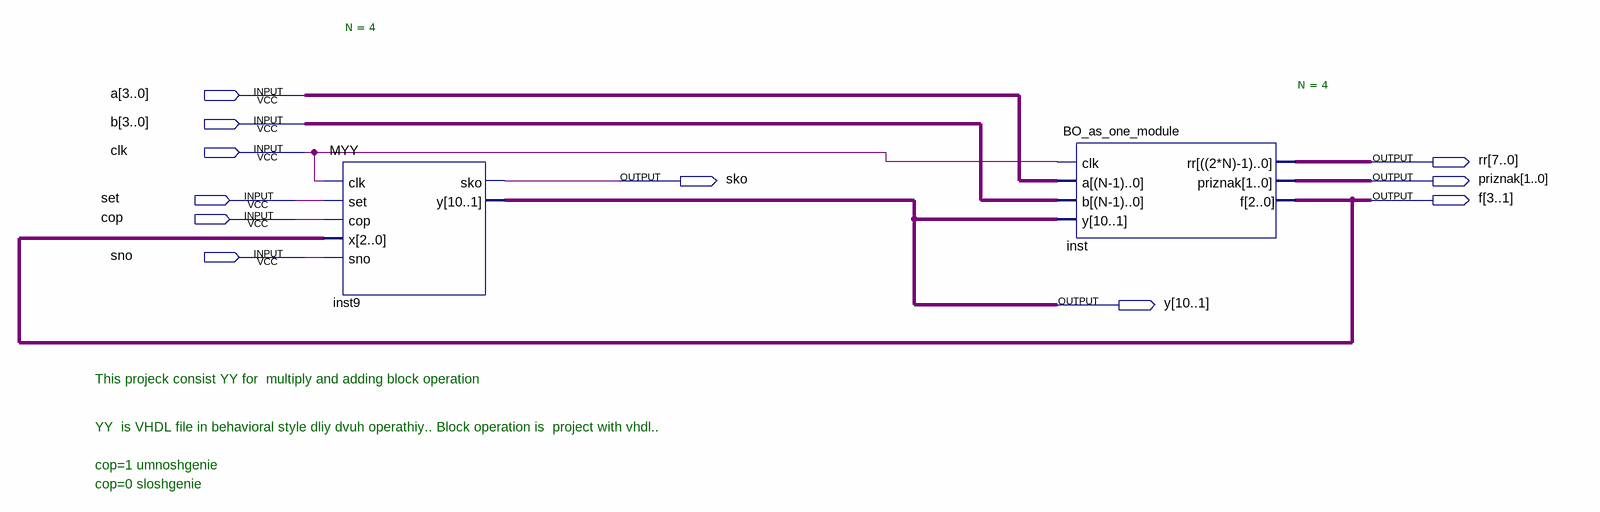
[diagram p0: schematic sheet]
// Quartus schematic alu_new.bdf as structural Verilog: 2 symbols, 11 pins
module alu_new (
  input  [3:0] a,
  input  [3:0] b,
  input  clk,
  input  set,
  input  cop,
  input  sno,
  output [7:0] rr,
  output sko,
  output [1:0] priznak,
  output [3:1] f,
  output [10:1] y
);

  MYY #(.N(4)) inst9 (.clk(clk), .set(set), .cop(cop), .x(f), .sno(sno), .sko(sko), .y(y));
  BO_as_one_module #(.N(4)) inst (.clk(clk), .a(a), .b(b), .y(y), .rr(rr), .priznak(priznak), .f(f));

  // Notes on the sheet:
  //   This projeck consist YY for  multiply and adding block operation
  //   YY  is VHDL file in behavioral style dliy dvuh operathiy.. Block operation is  project with vhdl..
  //   cop=1 umnoshgenie
  //   cop=0 sloshgenie
endmodule
